# Altium schematic sheet MCU.SchDoc
size A4
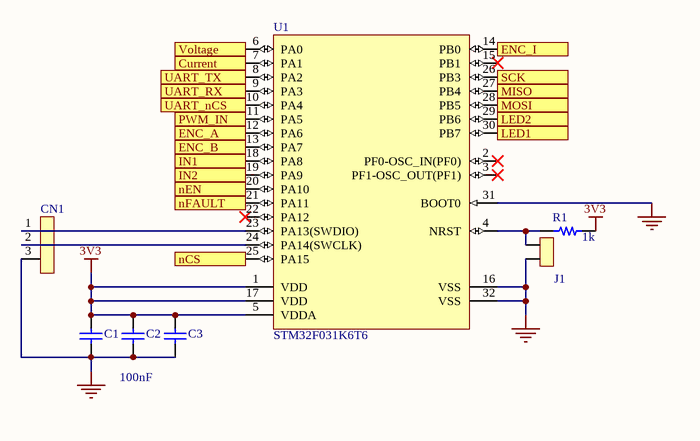
[diagram p0: MCU.SchDoc]

## Parts
C1  Cap  [0402]  (value not drawn)
C2  value 100nF  [0402]  (hidden comment: Cap)
C3  Cap  [0402]  (value not drawn)
CN1  3P-2.5mm  [2.5mm-3P]  (value not drawn)
J1  Jumper  [Jumper]  (value not drawn)
R1  1k  [0805 - duplicate]
U1  STM32F031K6T6  [STM-LQFP32_N]

## Ports
Current, ENC_A, ENC_B, ENC_I, IN1, IN2, LED1, LED2, MISO, MOSI, nCS, nEN, nFAULT, PWM_IN, SCK, UART_nCS, UART_RX, UART_TX, Voltage

## Nets
3V3: C1.2 C2.2 C3.2 R1.2 U1.1(VDD) U1.5(VDDA) U1.17(VDD)
GND: C1.1 C2.1 C3.1 CN1.3 J1.2 U1.16(VSS) U1.31(BOOT0) U1.32(VSS)
Current: U1.7(PA1) ; port Current
ENC_A: U1.12(PA6) ; port ENC_A
ENC_B: U1.13(PA7) ; port ENC_B
ENC_I: U1.14(PB0) ; port ENC_I
IN1: U1.18(PA8) ; port IN1
IN2: U1.19(PA9) ; port IN2
LED1: U1.30(PB7) ; port LED1
LED2: U1.29(PB6) ; port LED2
MISO: U1.27(PB4) ; port MISO
MOSI: U1.28(PB5) ; port MOSI
nCS: U1.25(PA15) ; port nCS
nEN: U1.20(PA10) ; port nEN
nFAULT: U1.21(PA11) ; port nFAULT
PWM_IN: U1.11(PA5) ; port PWM_IN
SCK: U1.26(PB3) ; port SCK
UART_nCS: U1.10(PA4) ; port UART_nCS
UART_RX: U1.9(PA3) ; port UART_RX
UART_TX: U1.8(PA2) ; port UART_TX
Voltage: U1.6(PA0) ; port Voltage
NetCN1_1: CN1.1 U1.23(PA13(SWDIO))
NetCN1_2: CN1.2 U1.24(PA14(SWCLK))
NetJ1_1: J1.1 R1.1 U1.4(NRST)

Not connected (* = marked no-connect by the designer): U1 2(PF0-OSC_IN(PF0))* 3(PF1-OSC_OUT(PF1))* 15(PB1)* 22(PA12)*

## Library data of the parts
C1 C3 = Cap: Value: 100pF; Published: 8-Jun-2000; LatestRevisionDate: 17-Jul-2002; LatestRevisionNote: Re-released for DXP Platform.; PackageReference: RAD-0.3; Publisher: Altium Limited; PackageDescription: Radial Cap, Thru-Hole; 2 Leads; 0.3 in Pin Spacing
R1 = Resistor
U1 = CMP-0304-00091-2: ARM Cortex-M0 32-bit MCU, 32 KB Flash, 4 KB Internal RAM, 25 I/Os, 32-Pin LQFP, -40 to 85 degC, Tray; Manufacturer: STMicroelectronics; Operating Frequency(F) (Processor speed) (MHz): 48; Supply Voltage(Vcc) min (V): 2; Internal RAM Size (kB): 4; I/Os (High Current): 25; FLASH Size (Prog) (kB): 32; Package Description: 32-Pin Low Profile Quad Flat Package, 7 x 7 mm Body, 0.8 mm Pitch; Packing: Tray; Package Reference: LQFP32; ComponentLink2URL: http://www.st.com/st-web-ui/static/active/en/resource/technical/document/datasheet/DM00104043.pdf; ComponentLink2Description: Datasheet; ComponentLink1Description: Manufacturer URL; PartNumber: STM32F031K6T6; ComponentLink1URL: http://www.st.com/; Mounting Technology: Surface Mount; DatasheetVersion: Rev. 3; Core: ARM Cortex-M0
C2 = Cap: Published: 8-Jun-2000; LatestRevisionDate: 17-Jul-2002; LatestRevisionNote: Re-released for DXP Platform.; PackageReference: RAD-0.3; Publisher: Altium Limited; PackageDescription: Radial Cap, Thru-Hole; 2 Leads; 0.3 in Pin Spacing